# EasyEDA schematic SCH_HV-Switch_2025-05-17.json
TITLE: HV Switch; REV: 1.0; Date: 2024-10-29; Sheet: 1/1; Drawn By: Mahboob Liaquat; Company: Analogic
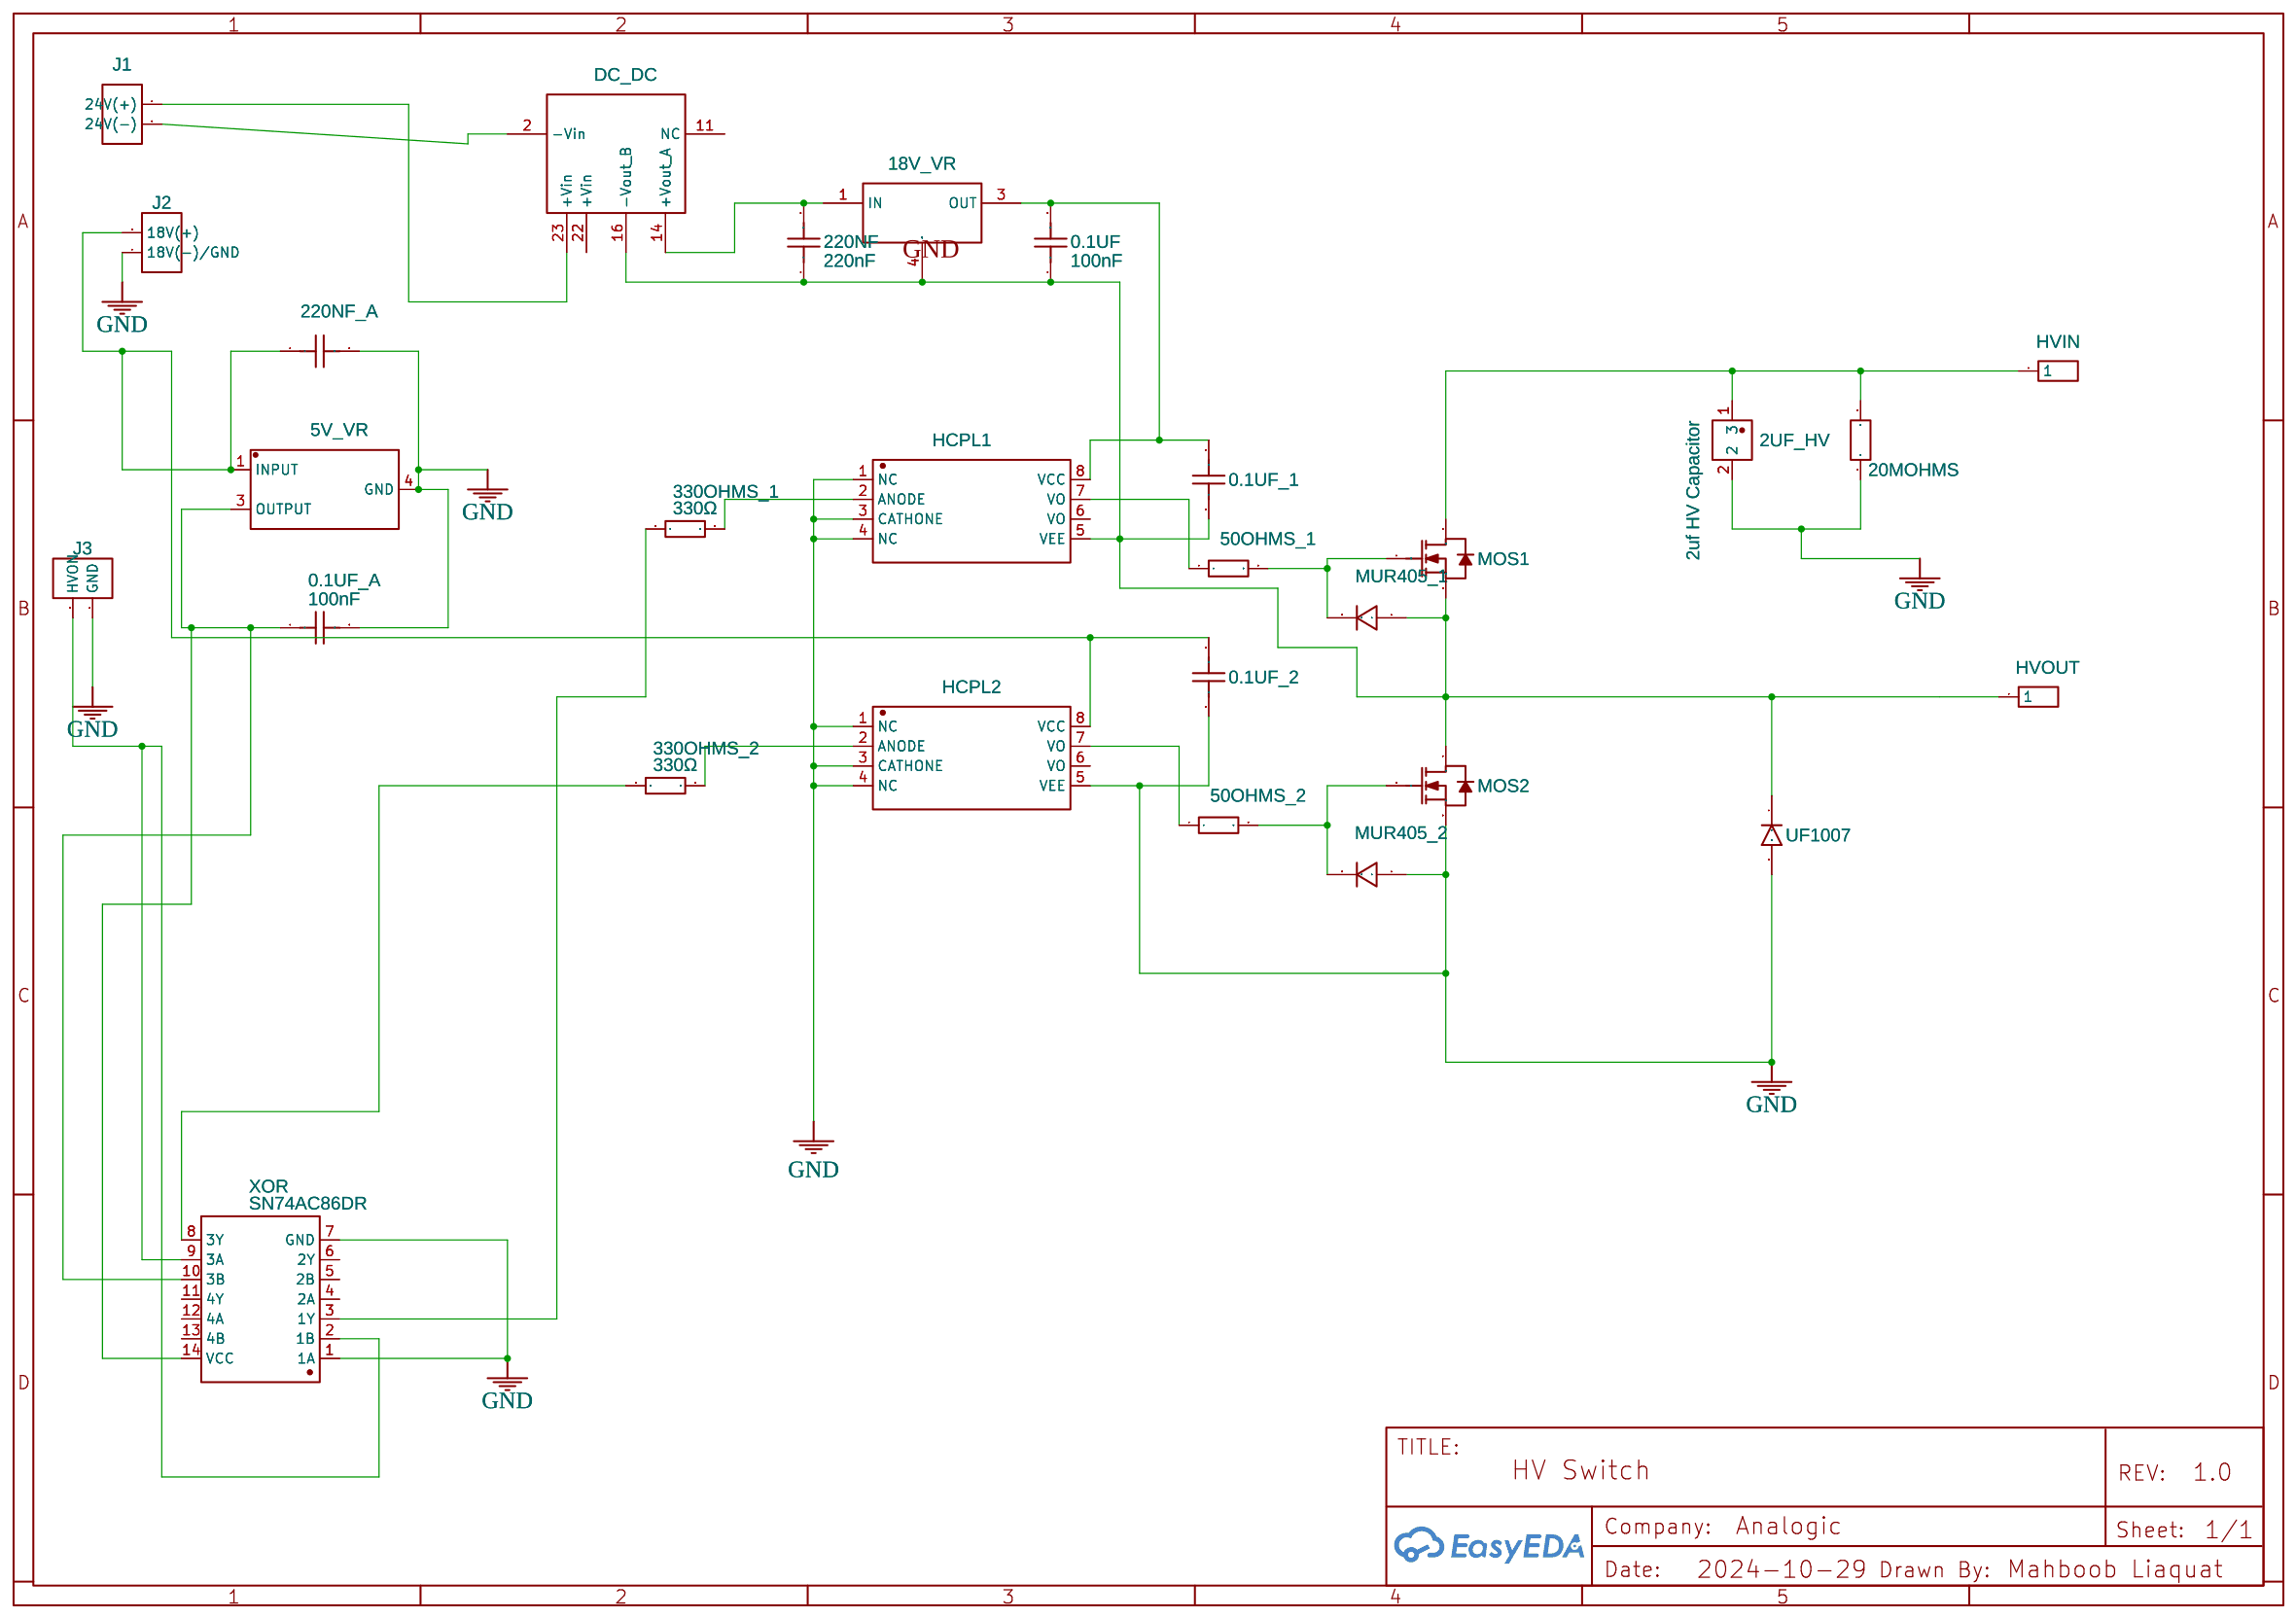
[diagram p0: schematic sheet]

## Parts
0.1UF  100nF  [C0805]
0.1UF_1  100nF  [C0805]
0.1UF_2  100nF  [C0805]
0.1UF_A  100nF  [C0805]
2UF_HV  2uf HV Capacitor  [2UF HV]
5V_VR  MC7805BDTG  [DPAK_L6.5-W6.0-P2.29-LS9.9-BR]
18V_VR  MC7818CD2TR4G  [TO-263-2_L10.0-W9.2-P5.08-LS14.2-BL]
20MOHMS  3.32MΩ  [R2010]
50OHMS_1  49.9Ω  [R1206]
50OHMS_2  49.9Ω  [R1206]
220NF  220nF  [C1206]
220NF_A  220nF  [C1206]
330OHMS_1  330Ω  [R0603]
330OHMS_2  330Ω  [R0603]
DC_DC  DC DC converter  [DC DC 2424 CONVERTER]
HCPL1  HCPL-3120-300E  [SMD-8_L9.7-W6.4-P2.54-LS9.7-BL]
HCPL2  HCPL-3120-300E  [SMD-8_L9.7-W6.4-P2.54-LS9.7-BL]
HVIN  HVIN  [HDR-M-2.54_1X1]
HVOUT  HVOUT  [HDR-M-2.54_1X1]
J1  282836-2  [282836-2]
J2  282836-2  [282836-2]
J3  282836-2  [282836-2]
MOS1  IXTA1N200P3HV  [TO-263-2_L10.1-W9.1-P5.08-LS15.2-BR-1]
MOS2  IXTA1N200P3HV  [TO-263-2_L10.1-W9.1-P5.08-LS15.2-BR-1]
MUR405_1  MURS105T3G  [SMB_L4.6-W3.6-LS5.3-R-RD]
MUR405_2  MURS105T3G  [SMB_L4.6-W3.6-LS5.3-R-RD]
UF1007  US1M-13-F  [SMA_L4.3-W2.6-LS5.2-RD]
XOR  SN74AC86DR  [SOIC-14_L8.7-W3.9-P1.27-LS6.0-BL]

## Library data of the parts
0.1UF 0.1UF_1 0.1UF_2 0.1UF_A = C2012X7T2E104K125AE: Contributor: lcsc; Supplier: LCSC; Supplier Part: C2181172; Manufacturer: TDK; JLCPCB Part Class: Extended Part
2UF_HV = 2uf HV Capacitor: Contributor: mliaqu
5V_VR = MC7805BDTG: Contributor: LCSC; Supplier: LCSC; Supplier Part: C83632; Manufacturer: onsemi(安森美); JLCPCB Part Class: Extended Part
18V_VR = MC7818CD2TR4G: Contributor: LCSC; Supplier: LCSC; Supplier Part: C462852; Manufacturer: onsemi(安森美); JLCPCB Part Class: Extended Part
20MOHMS = CRMA2010AF3M32FKEF: Supplier: LCSC; Supplier Part: C2091379; Manufacturer: VISHAY(威世); JLCPCB Part Class: Extended Part; Contributor: lcsc; Package Display: No
50OHMS_1 50OHMS_2 = RC1206FR-0749R9L: Contributor: LCSC; Supplier: LCSC; Supplier Part: C246049; Manufacturer: YAGEO(国巨); JLCPCB Part Class: Extended Part
220NF 220NF_A = CC1206JKX7R9BB224: Contributor: LCSC; Supplier: LCSC; Supplier Part: C527274; Manufacturer: YAGEO(国巨); JLCPCB Part Class: Extended Part
330OHMS_1 330OHMS_2 = RC0603JR-07330RL: Supplier: LCSC; Manufacturer: YAGEO(国巨); Supplier Part: C105879; JLCPCB Part Class: Extended Part
DC_DC = DC DC converter: Contributor: mliaqu
HCPL1 HCPL2 = HCPL-3120-300E: Contributor: LCSC; Supplier: LCSC; Supplier Part: C188743; Manufacturer: Broadcom/AVAGO(安华高); JLCPCB Part Class: Extended Part
HVIN HVOUT = HDR-M-2.54_1x1: Supplier Part: C81276; Supplier: LCSC; Contributor: LCEDA_Lib
J1 = 282836-2: Manufacturer: TE-Connectivity; Contributor: kaziu54321; Package Display: No
J2 J3 = 282836-2: Manufacturer: TE-Connectivity; Contributor: kaziu54321
MOS1 MOS2 = IXTA1N200P3HV: Contributor: lcsc; Supplier: LCSC; Supplier Part: C3291172; Manufacturer: Littelfuse/IXYS; JLCPCB Part Class: Extended Part
MUR405_1 MUR405_2 = MURS105T3G: Contributor: LCSC; Supplier Part: C146785; Supplier: LCSC; Manufacturer: onsemi(安森美); JLCPCB Part Class: Extended Part
UF1007 = US1M-13-F: Contributor: LCSC; Supplier: LCSC; Manufacturer: DIODES(美台); Supplier Part: C99333; JLCPCB Part Class: Extended Part
XOR = SN74AC86DR: Contributor: LCSC; Supplier: LCSC; Supplier Part: C2867667; Manufacturer: TI(德州仪器); JLCPCB Part Class: Extended Part

## Nets
GND: 0.1UF_2.1 0.1UF_A.2 2UF_HV.2 5V_VR.4(GND) 20MOHMS.1 220NF_A.2 HCPL1.1(NC) HCPL1.3(CATHONE) HCPL1.4(NC) HCPL2.1(NC) HCPL2.3(CATHONE) HCPL2.4(NC) HCPL2.5(VEE) J2.1(18V(-)/GND) J3.1(GND) MOS2.3(S) MUR405_2.1 UF1007.2 XOR.1(1A) XOR.7(GND)
Net-(0.1UF-1): 0.1UF.1 0.1UF_1.2 18V_VR.4(GND) 220NF.1 DC_DC.16(-Vout B) HCPL1.5(VEE) HVOUT.1 MOS1.3(S) MOS2.2(D) MUR405_1.1 UF1007.1
Net-(0.1UF-2): 0.1UF.2 0.1UF_1.1 18V_VR.3(OUT) HCPL1.8(VCC)
Net-(0.1UF_2-2): 0.1UF_2.2 5V_VR.1(INPUT) 220NF_A.1 HCPL2.8(VCC) J2.2(18V(+))
Net-(0.1UF_A-1): 0.1UF_A.1 5V_VR.3(OUTPUT) XOR.10(3B) XOR.14(VCC)
Net-(2UF_HV-1): 2UF_HV.1(3) 20MOHMS.2 HVIN.1 MOS1.2(D)
Net-(18V_VR-1): 18V_VR.1(IN) 220NF.2 DC_DC.14(+Vout A)
Net-(50OHMS_1-1): 50OHMS_1.1 HCPL1.7(VO)
Net-(50OHMS_1-2): 50OHMS_1.2 MOS1.1(G) MUR405_1.2
Net-(50OHMS_2-1): 50OHMS_2.1 HCPL2.7(VO)
Net-(50OHMS_2-2): 50OHMS_2.2 MOS2.1(G) MUR405_2.2
Net-(330OHMS_1-1): 330OHMS_1.1 XOR.3(1Y)
Net-(330OHMS_1-2): 330OHMS_1.2 HCPL1.2(ANODE)
Net-(330OHMS_2-1): 330OHMS_2.1 XOR.8(3Y)
Net-(330OHMS_2-2): 330OHMS_2.2 HCPL2.2(ANODE)
Net-(DC_DC-2): DC_DC.2(-Vin) J1.2(24V(-))
Net-(DC_DC-23): DC_DC.23(+Vin) J1.1(24V(+))
Net-(J3-2): J3.2(HVON) XOR.2(1B) XOR.9(3A)

Not connected (* = marked no-connect by the designer): DC_DC 11(NC) 22(+Vin); HCPL1 6(VO); HCPL2 6(VO); XOR 4(2A) 5(2B) 6(2Y) 11(4Y) 12(4A) 13(4B)
